# Altium project HVAMP_8CH.PrjPCB (part 3 of 3)

## Sheet HV_Amp_Discrete.SchDoc: Power
size 420 x 297 mm; Author: G.Kasprowicz; CompanyName: WUT ISE; DrawnBy: G.Kasprowicz; Organization: WUT ISE; Address1: PW ISE; Address2: Nowowiejska 15/19 00-665 Warsaw; Address3: gkasprow@gmail.com; DocumentNumber: 2; Revision: 2; SheetNumber: 2; SheetTotal: 5; ModifiedBy: -; CheckedDate: -; Title2: Stage; DivGrp: WUT ISE; Designer: G.Kasprowicz; ModifiedDate: -; ProjectName: Sensor Box
Used 8 times, as channels U_HV_Amp_Discrete0, U_HV_Amp_Discrete1, U_HV_Amp_Discrete2, U_HV_Amp_Discrete3, U_HV_Amp_Discrete4, U_HV_Amp_Discrete5, U_HV_Amp_Discrete6, U_HV_Amp_Discrete7. Parts and nets are listed once, with the designators drawn on the sheet.
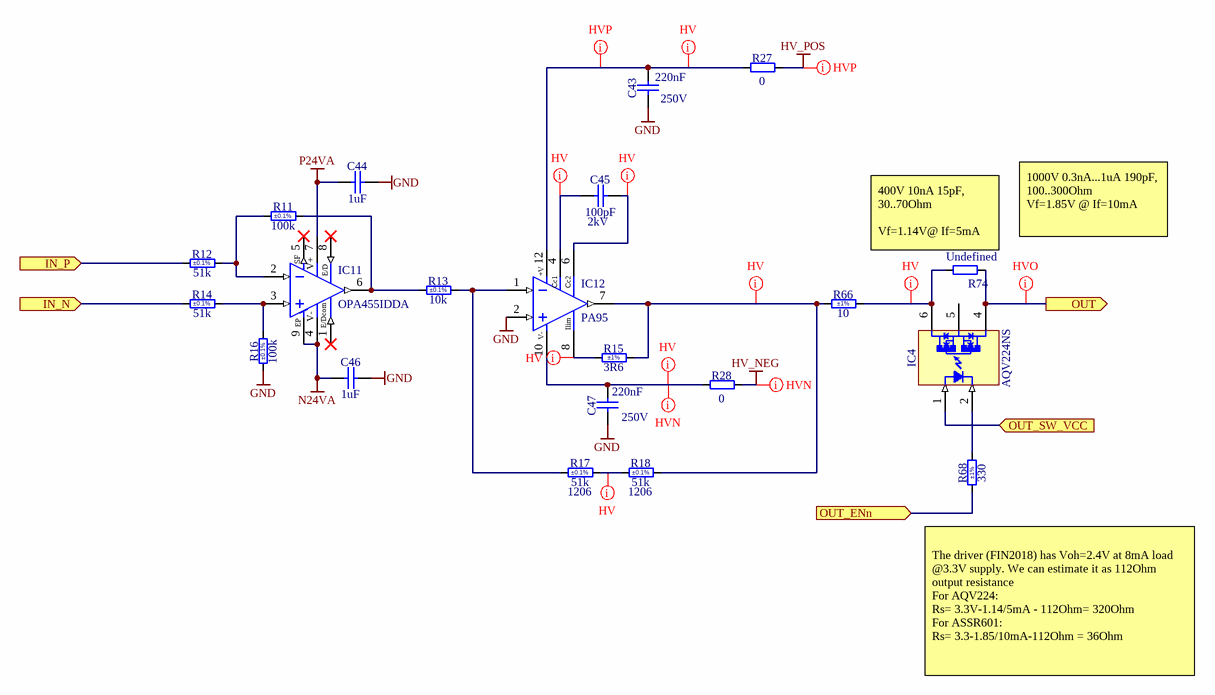
[diagram p4: HV_Amp_Discrete.SchDoc]

### Parts
C43  220nF  Voltage: 250V  [CAPC4532X165N]
C44  1uF  [CAPC1608X87N]
C45  100pF  Voltage: 2kV  [CAPC4620X203N]
C46  1uF  [CAPC1608X87N]
C47  220nF  Voltage: 250V  [CAPC4532X165N]
IC4  AQV224NS  [PANASONIC_AQV22(SOP)]
IC11  OPA455IDDA  [SOIC127P600X170-9N-R249X300]
IC12  PA95  [APEX_PA95_hflip]
R11  100k  Tolerance: ±0.1%  [RESC1608X55N]
R12  51k  Tolerance: ±0.1%  [RESC2012X60N]
R13  10k  Tolerance: ±0.1%  [RESC1608X64N]
R14  51k  Tolerance: ±0.1%  [RESC2012X60N]
R15  3R6  Tolerance: ±1%  [RESC1608X55N]
R16  100k  Tolerance: ±0.1%  [RESC1608X55N]
R17  51k  Tolerance: ±0.1%  Case: 1206  [RESC3216X65N]
R18  51k  Tolerance: ±0.1%  Case: 1206  [RESC3216X65N]
R27  0  [RESC1608X55N]
R28  0  [RESC1608X55N]
R66  10  Tolerance: ±1%  [RESC3216X65N]
R68  330  Tolerance: ±1%  [RESC1005X40N]
R74  Undefined  [RESC3216X65N]

### Ports
IN_N (in), IN_P (in), OUT (out), OUT_ENn (in), OUT_SW_VCC (in)

### Nets
GND: C43.1 C44.2 C46.2 C47.1 IC12.2(IN+) R16.1
HV_NEG: R28.2
HV_POS: R27.2
N24VA: C46.1 IC11.4(V-) IC11.9(Exposed_Pad)
P24VA: C44.1 IC11.7(V+)
IN_N: R14.1 ; port IN_N
IN_P: R12.1 ; port IN_P
OUT: IC4.4 R74.2 ; port OUT
OUT_ENn: R68.1 ; port OUT_ENn
OUT_SW_VCC: IC4.1(A) ; port OUT_SW_VCC
NetC43_2: C43.2 IC12.12(+Vs) R27.1
NetC45_1: C45.1 IC12.4(Cc1)
NetC45_2: C45.2 IC12.6(Cc2)
NetC47_2: C47.2 IC12.10(-Vs) R28.1
NetIC4_2: IC4.2(K) R68.2
NetIC4_6: IC4.6 R66.2 R74.1
NetIC11_2: IC11.2(IN-) R11.1 R12.2
NetIC11_3: IC11.3(IN+) R14.2 R16.2
NetIC11_6: IC11.6(OUT) R11.2 R13.1
NetIC12_1: IC12.1(IN-) R13.2 R17.1
NetIC12_7: IC12.7(OUT) R15.2 R18.2 R66.1
NetIC12_8: IC12.8(ILIM) R15.1
NetR17_2: R17.2 R18.1

Not connected (* = marked no-connect by the designer): IC4 5; IC11 1(E/Dcommon)* 5(Status_Flag)* 8(E/B)*

### Channels
U_HV_Amp_Discrete0: designators end in A; ports IN_N=DAC_OUT_N1 IN_P=DAC_OUT_P1 OUT=OUT0 OUT_ENn=OUT_CTRLn0 OUT_SW_VCC=OUT_SW_VCC
U_HV_Amp_Discrete1: designators end in B; ports IN_N=DAC_OUT_N2 IN_P=DAC_OUT_P2 OUT=OUT1 OUT_ENn=OUT_CTRLn1 OUT_SW_VCC=OUT_SW_VCC
U_HV_Amp_Discrete2: designators end in C; ports IN_N=DAC_OUT_N3 IN_P=DAC_OUT_P3 OUT=OUT2 OUT_ENn=OUT_CTRLn2 OUT_SW_VCC=OUT_SW_VCC
U_HV_Amp_Discrete3: designators end in D; ports IN_N=DAC_OUT_N4 IN_P=DAC_OUT_P4 OUT=OUT3 OUT_ENn=OUT_CTRLn3 OUT_SW_VCC=OUT_SW_VCC
U_HV_Amp_Discrete4: designators end in E; ports IN_N=DAC_OUT_N5 IN_P=DAC_OUT_P5 OUT=OUT4 OUT_ENn=OUT_CTRLn4 OUT_SW_VCC=OUT_SW_VCC
U_HV_Amp_Discrete5: designators end in F; ports IN_N=DAC_OUT_N6 IN_P=DAC_OUT_P6 OUT=OUT5 OUT_ENn=OUT_CTRLn5 OUT_SW_VCC=OUT_SW_VCC
U_HV_Amp_Discrete6: designators end in G; ports IN_N=DAC_OUT_N7 IN_P=DAC_OUT_P7 OUT=OUT6 OUT_ENn=OUT_CTRLn6 OUT_SW_VCC=OUT_SW_VCC
U_HV_Amp_Discrete7: designators end in H; ports IN_N=DAC_OUT_N8 IN_P=DAC_OUT_P8 OUT=OUT7 OUT_ENn=OUT_CTRLn7 OUT_SW_VCC=OUT_SW_VCC

### Layout directives
net class HV: NetC43A_2, NetC45A_1, NetC45A_2, NetC47A_2, NetIC4A_6, NetIC12A_7, NetIC12A_8, NetR17A_2
net class HVP: HV_POS, NetC43A_2
net class HVN: HV_NEG, NetC47A_2
net class HVO: OUT0

### Notes on the sheet
- (near R74) 400V 10nA 15pF, 30..70Ohm
  Vf=1.14V@ If=5mA
- (near R74) 1000V 0.3nA...1uA 190pF, 100..300Ohm
  Vf=1.85V @ If=10mA
- (near R68) The driver (FIN2018) has Voh=2.4V at 8mA load @3.3V supply. We can estimate it as 112Ohm output resistance
  For AQV224:
  Rs= 3.3V-1.14/5mA - 112Ohm= 320Ohm
  For ASSR601:
  Rs= 3.3-1.85/10mA-112Ohm = 36Ohm
- Project/Equipment
- Document
- Designer
- Drawn by
- Check.by
- Copyright WUT ISE 2020.
  This documentation describes Open Hardware and is licensed under the CERN OHL v.1.2. You may redistribute and modify this documentation under the terms of the CERN OHL v.1.2. (http://ohwr.org/CERNOHL). This documentation is distributed WITHOUT ANY EXPRESS OR IMPLIED WARRANTY, INCLUDING OF MERCHANTABILITY, SATISFACTORY QUALITY AND FITNESS FOR A PARTICULAR PURPOSE. Please see the CERN OHL v.1.2 for applicable conditions.
- Contact
- File
- Last Mod.
- Print Date
- Sheet
- Size
- A3
- of
- Rev
- (in symbol OA_OPA455) SF; E/D; E/Dcom; EP
- (in symbol OA_PA95) +V; V-; Ilim

### Library data of the parts
C43 C47 = CC1812_220NF_250V_10%_X7R_FT-CAP: Non-polarised capacitor; Part Description: Flexible Termination System (FT-CAP) SMD Multilayer Ceramic  Chip Capacitor; Manufacturer: KEMET; Manufacturer Part Number: C1812X224KARACTU; TC: X7R; Tolerance: ±10%; Part Number: CC1812_220NF_250V_10%_X7R_FT-CAP; Component Kind: Standard; Component Type: Standard; Pin Count: 2; Value: 220nF; Status: None; Case: 1812; Mounted: Yes; Socket: No; SMD: Yes; Sense: No; ComponentHeight: 1.65mm; HelpURL: \\cern.ch\dfs\Applications\Altium\Datasheets\CC1812_X7R_KEMET_FT-CAP.pdf; Author: CERN DEM JLC; CreateDate: 09.08.2018; LatestRevisionDate: 09.08.2018
C44 C46 = CC0603_1UF_50V_10%_X5R: Non-polarised capacitor; Part Description: SMD Multilayer Chip Ceramic Capacitor; Manufacturer: GENERIC; Manufacturer1 Part Number: C1608X5R1H105K080; Voltage: 50V; TC: X5R; Tolerance: ±10%; Part Number: CC0603_1UF_50V_10%_X5R; Component Kind: Standard; Component Type: Standard; Pin Count: 2; Value: 1uF; Status: None; Manufacturer Part Number: CC0603_1UF_50V_10%_X5R; Case: 0603; Mounted: Yes; Socket: No; SMD: Yes; Sense: No; Manufacturer1 Example: TDK; Manufacturer1 ComponentHeight: 0.9mm; HelpURL: \\cern.ch\dfs\Applications\Altium\Datasheets\CC0603_X5R_TDK_C.pdf; Author: CERN DEM JMW; CreateDate: 09.11.2015; LatestRevisionDate: 09.11.2015
C45 = CC1808_100PF_2KV_5%_C0G: Non-polarised capacitor; Part Description: High Voltage MLC Chip Capacitor; Manufacturer: GENERIC; Manufacturer1 Part Number: 1808GA101JAT1A; TC: C0G/NP0; Tolerance: ±5%; Part Number: CC1808_100PF_2KV_5%_C0G; Component Kind: Standard; Component Type: Standard; Pin Count: 2; Value: 100pF; Status: None; Manufacturer Part Number: CC1808_100PF_2KV_5%_C0G; Case: 1808; Mounted: Yes; Socket: No; SMD: Yes; Sense: No; Manufacturer1 Example: AVX; Manufacturer1 ComponentHeight: 2.03mm; HelpURL: \\cern.ch\dfs\Applications\Altium\Datasheets\CC1808_C0G_AVX_HV-MLC.pdf; Author: CERN DEM JLC; CreateDate: 25.11.2014; LatestRevisionDate: 16.11.2017
IC4 = OPTOMOS_AQV224NS: PhotoMOS Relay 400V 40mA; Part Description: GU SOP 1 Form A, PhotoMOS Relay, 400V 40mA; Manufacturer: PANASONIC; PressFit: No; Bonding: No; Part Number: AQV224NS; Component Kind: Standard; Component Type: Standard; Device: AQV224NS; Footprint: PANASONIC_AQV224NS; PackageDescription: PANASONIC Serie AQV21(SOP), 2.54mm Pitch; 6 Pin, 4.40mm W X 6.30mm L X 2.30mm H body; Manufacturer Part Number: AQV224NS; Pin Count: 6; Case: SOP6; Mounted: Yes; Socket: No; SMD: Yes; Sense: No; ComponentHeight: 2.3mm; HelpURL: \\cern.ch\dfs\Applications\Altium\Datasheets\AQV212S.pdf; ComponentLink1Description: Package Drawing; ComponentLink1URL: \\cern.ch\dfs\Applications\Altium\Datasheets\AQV21_Package-Drawing.pdf; Author: GK; CreateDate: 03.09.2010; LatestRevisionDate: 04.12.2018
IC11 = OA_OPA455: High-Voltage (150V), High-Current (50mA) Operational Amplifier, G=1 Stable; Manufacturer: TEXAS INSTRUMENTS; PressFit: No; Bonding: No; Part Number: OPA455IDDA; Component Kind: Standard; Component Type: Standard; Device: OPA455IDDA; PackageDescription: SOIC, 1.27mm Pitch; 8 Pin, 4.00mm W X 5.00mm L X 1.70mm H body (w/Thermal Tab 2.49 X 3.00mm), IPC Medium Density; Part Description: High-Voltage (150V), High-Current (50mA) Operational Amplifier, G=1 Stable; Manufacturer Part Number: OPA455IDDA; Pin Count: 9; Case: SOIC8; Mounted: Yes; Socket: No; SMD: Yes; Sense: No; ComponentHeight: 1.70mm; Author: GK; HelpURL: \\cern.ch\dfs\Applications\Altium\Datasheets\OPA454AIDDA.pdf; CreateDate: 23.05.2011; LatestRevisionDate: 23.05.2011
IC12 = OA_PA95: High Voltage Power Operational Amplifier; Part Number: PA95_hflip; Part Description: 100mA 900V High Voltage Power Operational Amplifier (DQ Case Style); Manufacturer: APEX; PressFit: No; Bonding: No; Component Kind: Standard; Component Type: Standard; Device: PA95; PackageDescription: Power SIP, DQ Package Style, Pitch 2.54mm, Reverse Right Angle Formed Original Straight Leads For Flipped  Horizontal Mount; Manufacturer Part Number: PA95; Pin Count: 8; Mounted: Yes; Socket: No; SMD: No; Sense: No; ComponentHeight: 10mm; Author: GK; HelpURL: \\cern.ch\dfs\Applications\Altium\Datasheets\PA94.pdf; ComponentLink1URL: \\cern.ch\dfs\Applications\Altium\Datasheets\PA94_v_Package.pdf; ComponentLink1Description: Package Drawing; CreateDate: 04.12.2008; LatestRevisionDate: 12.01.2010
R11 R16 = R0603_100K_0.1%_0.063W_10PPM: Resistor - 0.1%; Part Description: Thin Film Chip Resistor; Manufacturer: GENERIC; Manufacturer1 Part Number: RN73C1J100KBTDF; Power: 0.063W; TC: ±10ppm; PressFit: No; Part Number: R0603_100K_0.1%_0.063W_10PPM; Component Kind: Standard; Component Type: Standard; Pin Count: 2; Value: 100k; Status: Not Recommended; Manufacturer Part Number: R0603_100K_0.1%_0.063W_10PPM; Case: 0603; Mounted: Yes; Sense: No; Socket: No; SMD: Yes; Manufacturer1 Example: TYCO HOLSWORTHY; Manufacturer1 ComponentHeight: 0.55mm; HelpURL: \\cern.ch\dfs\Applications\Altium\Datasheets\R0603_Tyco_RN73.pdf; Author: CERN DEM JLC; CreateDate: 03.12.2007; LatestRevisionDate: 13.03.2008
R12 R14 = R0805_51K_0.1%_0.125W_10PPM: Resistor - 0.1%; Part Description: Thin Film Chip Resistor; Manufacturer: GENERIC; Manufacturer1 Part Number: ERA6ARB513V; Power: 0.125W; TC: ±10ppm; PressFit: No; Part Number: R0805_51K_0.1%_0.125W_10PPM; Component Kind: Standard; Component Type: Standard; Pin Count: 2; Value: 51k; Status: Not Recommended; Manufacturer Part Number: R0805_51K_0.1%_0.125W_10PPM; Case: 0805; Mounted: Yes; Sense: No; Socket: No; SMD: Yes; Manufacturer1 Example: PANASONIC; Manufacturer1 ComponentHeight: 0.6mm; HelpURL: \\cern.ch\dfs\Applications\Altium\Datasheets\R0805_PANASONIC_ERA.pdf; Author: CERN DEM BC; CreateDate: 26.09.2019; LatestRevisionDate: 26.09.2019
R13 = R0603_10K_0.1%_0.1W_25PPM: Resistor - 0.1%; Part Description: Thin Film Chip Resistor; Manufacturer: GENERIC; Manufacturer1 Part Number: ERA3AEB103V; Power: 0.1W; TC: ±25ppm/°C; PressFit: No; Part Number: R0603_10K_0.1%_0.1W_25PPM; Component Kind: Standard; Component Type: Standard; Pin Count: 2; Value: 10k; Status: Not Recommended; Manufacturer Part Number: R0603_10K_0.1%_0.1W_25PPM; Case: 0603; Mounted: Yes; Sense: No; Socket: No; SMD: Yes; Manufacturer1 Example: PANASONIC; Manufacturer1 ComponentHeight: 0.55mm; HelpURL: \\cern.ch\dfs\Applications\Altium\Datasheets\R0603_PANASONIC_ERA.pdf; Author: CERN DEM JMW; CreateDate: 09.11.2015; LatestRevisionDate: 11.01.2017
R15 = R0603_3R6_1%_0.1W_200PPM: Resistor - 1%; Part Description: General Purpose Thick Film Chip Resistor; Manufacturer: GENERIC; Manufacturer1 Part Number: 232270463608L or RC0603FR-073R6L; Power: 0.1W; TC: ±200ppm/°C; PressFit: No; Part Number: R0603_3R6_1%_0.1W_200PPM; Component Kind: Standard; Component Type: Standard; Pin Count: 2; Value: 3R6; Status: Preferred; Manufacturer Part Number: R0603_3R6_1%_0.1W_200PPM; Case: 0603; Mounted: Yes; Sense: No; Socket: No; SMD: Yes; Manufacturer1 Example: YAGEO PHYCOMP; Manufacturer1 ComponentHeight: 0.65mm; HelpURL: \\cern.ch\dfs\Applications\Altium\Datasheets\R0603_Phycomp_RC0603.pdf; Author: CERN DEM JLC; CreateDate: 03.12.2007; LatestRevisionDate: 17.10.2012
R17 R18 = R1206_51K_0.1%_0.25W_25PPM: Resistor - 0.1%; Part Description: Thin Film Chip Resistor; Manufacturer: GENERIC; Manufacturer1 Part Number: RN73H2BTTD5102B25; Power: 0.25W; TC: ±25ppm/°C; PressFit: No; Part Number: R1206_51K_0.1%_0.25W_25PPM; Component Kind: Standard; Component Type: Standard; Pin Count: 2; Value: 51k; Status: Not Recommended; Manufacturer Part Number: R1206_51K_0.1%_0.25W_25PPM; Mounted: Yes; Sense: No; Socket: No; SMD: Yes; Manufacturer1 Example: KOA; Manufacturer1 ComponentHeight: 0.70mm; HelpURL: \\cern.ch\dfs\Applications\Altium\Datasheets\R1206_KOA_RN73H.pdf; Author: CERN DEM JLC; CreateDate: 03.12.2007; LatestRevisionDate: 13.03.2008
R27 R28 = R0603_0R_JUMPER: Resistor; Part Description: 1A (0.05R Max DC Resistance) Zero Ohm Jumper; Manufacturer: GENERIC; Manufacturer1 Part Number: NRC06Z0; PressFit: No; Part Number: R0603_0R_JUMPER; Component Kind: Standard; Component Type: Standard; Pin Count: 2; Value: 0; Status: Preferred; Manufacturer Part Number: R0603_0R_JUMPER; Case: 0603; Mounted: Yes; Sense: No; Socket: No; SMD: Yes; Manufacturer1 Example: NIC COMPONENT; Manufacturer1 ComponentHeight: 0.55mm; HelpURL: \\cern.ch\dfs\Applications\Altium\Datasheets\R0603_NIC_NRC.pdf; Author: CERN DEM JLC; CreateDate: 03.12.2007; LatestRevisionDate: 13.03.2008
R66 = R1206_10R_1%_0.25W_200PPM: Resistor - 1%; Part Description: General Purpose Thick Film Chip Resistor; Manufacturer: GENERIC; Manufacturer1 Part Number: NRC12F10R0TRF; Power: 0.25W; TC: ±200ppm/°C; PressFit: No; Part Number: R1206_10R_1%_0.25W_200PPM; Component Kind: Standard; Component Type: Standard; Pin Count: 2; Value: 10; Status: Preferred; Manufacturer Part Number: R1206_10R_1%_0.25W_200PPM; Case: 1206; Mounted: Yes; Sense: No; Socket: No; SMD: Yes; Manufacturer1 Example: NIC COMPONENT; Manufacturer1 ComponentHeight: 0.65mm; HelpURL: \\cern.ch\dfs\Applications\Altium\Datasheets\R1206_NIC_NRC.pdf; Author: CERN DEM JLC; CreateDate: 24.06.2009; LatestRevisionDate: 24.06.2009
R68 = R0402_330R_1%_0.0625W_100PPM: Resistor - 1%; Part Description: General Purpose Thick Film Chip Resistor; Manufacturer: GENERIC; Manufacturer1 Part Number: 232270673301L; TC: ±100ppm/°C; PressFit: No; Part Number: R0402_330R_1%_0.0625W_100PPM; Component Kind: Standard; Component Type: Standard; Pin Count: 2; Value: 330; Status: Not Recommended; Power: 0.0625W; Manufacturer Part Number: R0402_330R_1%_0.0625W_100PPM; Case: 0402; Mounted: Yes; Sense: No; Socket: No; SMD: Yes; Manufacturer1 Example: YAGEO PHYCOMP; Manufacturer1 ComponentHeight: 0.4mm; HelpURL: \\cern.ch\dfs\Applications\Altium\Datasheets\R0402_Phycomp_RC0402.pdf; Author: CERN DEM JLC; CreateDate: 03.12.2007; LatestRevisionDate: 17.10.2012
R74 = R1206_NO-VALUE: Resistor; Part Description: Reserved Footprint For a 1206 (3216) Chip Resistor; PressFit: No; Mounted: No; Part Number: R1206_NO-VALUE; Component Kind: Standard; Component Type: Standard; Pin Count: 2; Value: Undefined; Status: None; Manufacturer: Undefined; Manufacturer Part Number: R1206_NO-VALUE; Case: 1206; Sense: No; Socket: No; SMD: Yes; Manufacturer1 Example: Undefined; Manufacturer1 Part Number: Undefined; Manufacturer1 ComponentHeight: Undefined; HelpURL: Undefined; Author: CERN DEM JLC; CreateDate: 03.12.2007; LatestRevisionDate: 13.03.2008

## Nets that join several sheets
GND: HVAMP_8CH (24 pins), power_supplies_HVAMP (89 pins), mechanics (R43.1 R44.1), LVDS_IFC_HVAMP (19 pins), U_HV_Amp_Discrete0 (6 pins), U_HV_Amp_Discrete1 (6 pins), U_HV_Amp_Discrete2 (6 pins), U_HV_Amp_Discrete3 (6 pins), U_HV_Amp_Discrete4 (6 pins), U_HV_Amp_Discrete5 (6 pins), U_HV_Amp_Discrete6 (6 pins), U_HV_Amp_Discrete7 (6 pins)
HV_NEG: power_supplies_HVAMP (8 pins), U_HV_Amp_Discrete0 (R28A.2), U_HV_Amp_Discrete1 (R28B.2), U_HV_Amp_Discrete2 (R28C.2), U_HV_Amp_Discrete3 (R28D.2), U_HV_Amp_Discrete4 (R28E.2), U_HV_Amp_Discrete5 (R28F.2), U_HV_Amp_Discrete6 (R28G.2), U_HV_Amp_Discrete7 (R28H.2)
HV_POS: power_supplies_HVAMP (8 pins), U_HV_Amp_Discrete0 (R27A.2), U_HV_Amp_Discrete1 (R27B.2), U_HV_Amp_Discrete2 (R27C.2), U_HV_Amp_Discrete3 (R27D.2), U_HV_Amp_Discrete4 (R27E.2), U_HV_Amp_Discrete5 (R27F.2), U_HV_Amp_Discrete6 (R27G.2), U_HV_Amp_Discrete7 (R27H.2)
N24VA: power_supplies_HVAMP (6 pins), U_HV_Amp_Discrete0 (C46A.1 IC11A.4 IC11A.9), U_HV_Amp_Discrete1 (C46B.1 IC11B.4 IC11B.9), U_HV_Amp_Discrete2 (C46C.1 IC11C.4 IC11C.9), U_HV_Amp_Discrete3 (C46D.1 IC11D.4 IC11D.9), U_HV_Amp_Discrete4 (C46E.1 IC11E.4 IC11E.9), U_HV_Amp_Discrete5 (C46F.1 IC11F.4 IC11F.9), U_HV_Amp_Discrete6 (C46G.1 IC11G.4 IC11G.9), U_HV_Amp_Discrete7 (C46H.1 IC11H.4 IC11H.9)
P3V3: HVAMP_8CH (C54.2 IC14.5), power_supplies_HVAMP (8 pins), LVDS_IFC_HVAMP (8 pins)
P3V3_MP: power_supplies_HVAMP (9 pins), LVDS_IFC_HVAMP (C38.2 IC32.4 J37.30 TP13.1)
P12V0: HVAMP_8CH (D3.1 FL1.2 R40.1), power_supplies_HVAMP (11 pins), LVDS_IFC_HVAMP (J37.28 J37.29)
P24VA: power_supplies_HVAMP (6 pins), U_HV_Amp_Discrete0 (C44A.1 IC11A.7), U_HV_Amp_Discrete1 (C44B.1 IC11B.7), U_HV_Amp_Discrete2 (C44C.1 IC11C.7), U_HV_Amp_Discrete3 (C44D.1 IC11D.7), U_HV_Amp_Discrete4 (C44E.1 IC11E.7), U_HV_Amp_Discrete5 (C44F.1 IC11F.7), U_HV_Amp_Discrete6 (C44G.1 IC11G.7), U_HV_Amp_Discrete7 (C44H.1 IC11H.7)
DAC_OUT_N1: HVAMP_8CH (J2.2), U_HV_Amp_Discrete0 (R14A.1)
DAC_OUT_N2: HVAMP_8CH (J2.5), U_HV_Amp_Discrete1 (R14B.1)
DAC_OUT_N3: HVAMP_8CH (J2.8), U_HV_Amp_Discrete2 (R14C.1)
DAC_OUT_N4: HVAMP_8CH (J2.11), U_HV_Amp_Discrete3 (R14D.1)
DAC_OUT_N5: HVAMP_8CH (J2.14), U_HV_Amp_Discrete4 (R14E.1)
DAC_OUT_N6: HVAMP_8CH (J2.17), U_HV_Amp_Discrete5 (R14F.1)
DAC_OUT_N7: HVAMP_8CH (J2.20), U_HV_Amp_Discrete6 (R14G.1)
DAC_OUT_N8: HVAMP_8CH (J2.23), U_HV_Amp_Discrete7 (R14H.1)
DAC_OUT_P1: HVAMP_8CH (J2.1), U_HV_Amp_Discrete0 (R12A.1)
DAC_OUT_P2: HVAMP_8CH (J2.4), U_HV_Amp_Discrete1 (R12B.1)
DAC_OUT_P3: HVAMP_8CH (J2.7), U_HV_Amp_Discrete2 (R12C.1)
DAC_OUT_P4: HVAMP_8CH (J2.10), U_HV_Amp_Discrete3 (R12D.1)
DAC_OUT_P5: HVAMP_8CH (J2.13), U_HV_Amp_Discrete4 (R12E.1)
DAC_OUT_P6: HVAMP_8CH (J2.16), U_HV_Amp_Discrete5 (R12F.1)
DAC_OUT_P7: HVAMP_8CH (J2.19), U_HV_Amp_Discrete6 (R12G.1)
DAC_OUT_P8: HVAMP_8CH (J2.22), U_HV_Amp_Discrete7 (R12H.1)
I2C_SCL: power_supplies_HVAMP (R50.1), LVDS_IFC_HVAMP (IC32.1 J37.27 TP12.1)
I2C_SDA: power_supplies_HVAMP (R47.1), LVDS_IFC_HVAMP (IC32.3 J37.26 TP11.1)
OUT0: HVAMP_8CH (J4.1), U_HV_Amp_Discrete0 (IC4A.4 R74A.2)
OUT1: HVAMP_8CH (J9.1), U_HV_Amp_Discrete1 (IC4B.4 R74B.2)
OUT2: HVAMP_8CH (J1.1), U_HV_Amp_Discrete2 (IC4C.4 R74C.2)
OUT3: HVAMP_8CH (J3.1), U_HV_Amp_Discrete3 (IC4D.4 R74D.2)
OUT4: HVAMP_8CH (J5.1), U_HV_Amp_Discrete4 (IC4E.4 R74E.2)
OUT5: HVAMP_8CH (J6.1), U_HV_Amp_Discrete5 (IC4F.4 R74F.2)
OUT6: HVAMP_8CH (J7.1), U_HV_Amp_Discrete6 (IC4G.4 R74G.2)
OUT7: HVAMP_8CH (J8.1), U_HV_Amp_Discrete7 (IC4H.4 R74H.2)
OUT_CTRLn0: HVAMP_8CH (R21.2), LVDS_IFC_HVAMP (IC9.7), U_HV_Amp_Discrete0 (R68A.1)
OUT_CTRLn1: HVAMP_8CH (R22.2), LVDS_IFC_HVAMP (IC9.6), U_HV_Amp_Discrete1 (R68B.1)
OUT_CTRLn2: HVAMP_8CH (R24.2), LVDS_IFC_HVAMP (IC15.7), U_HV_Amp_Discrete2 (R68C.1)
OUT_CTRLn3: HVAMP_8CH (R26.2), LVDS_IFC_HVAMP (IC15.6), U_HV_Amp_Discrete3 (R68D.1)
OUT_CTRLn4: HVAMP_8CH (R31.2), LVDS_IFC_HVAMP (IC16.7), U_HV_Amp_Discrete4 (R68E.1)
OUT_CTRLn5: HVAMP_8CH (R32.2), LVDS_IFC_HVAMP (IC16.6), U_HV_Amp_Discrete5 (R68F.1)
OUT_CTRLn6: HVAMP_8CH (R33.2), LVDS_IFC_HVAMP (IC17.7), U_HV_Amp_Discrete6 (R68G.1)
OUT_CTRLn7: HVAMP_8CH (R34.2), LVDS_IFC_HVAMP (IC17.6), U_HV_Amp_Discrete7 (R68H.1)
OUT_SW_VCC: HVAMP_8CH (9 pins), U_HV_Amp_Discrete0 (IC4A.1), U_HV_Amp_Discrete1 (IC4B.1), U_HV_Amp_Discrete2 (IC4C.1), U_HV_Amp_Discrete3 (IC4D.1), U_HV_Amp_Discrete4 (IC4E.1), U_HV_Amp_Discrete5 (IC4F.1), U_HV_Amp_Discrete6 (IC4G.1), U_HV_Amp_Discrete7 (IC4H.1)

## Assembly variants
Default: not fitted R74A R74B R74C R74D R74E R74F R74G R74H